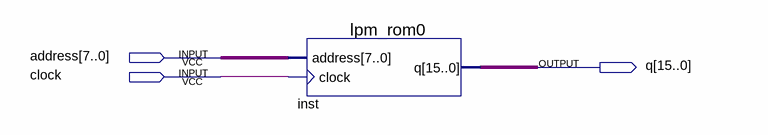
[diagram p0: schematic sheet]
// Quartus schematic lpm_rom_256_16.bdf as structural Verilog: 1 symbols, 3 pins
module lpm_rom_256_16 (
  input  [7:0] address,
  input  clock,
  output [15:0] q
);

  lpm_rom0 inst (.address(address), .clock(clock), .q(q));
endmodule
